# Altium project DVD.PrjPcb (part 3 of 3)
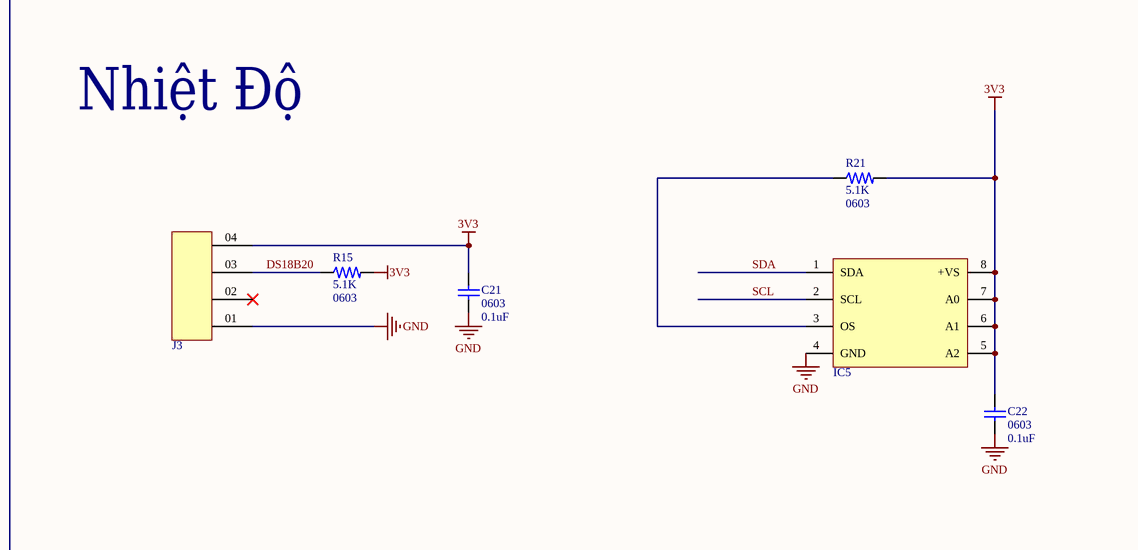
[diagram p7: DVD.SchDoc, bottom right]

## Sheet DVD.SchDoc (continued)

### Library data of the parts (continued)
R12 = RES; 2.2K; SMD; 0603; RMCF0603FT2K20: Res Thick Film 0603 2.2K Ohm 1% 0.1W(1/10W) ±100ppm/C Pad SMD Automotive T/R; Manufacturer: Stackpole Electronics; Voltage Rating: 75V; Designer: TVBac; Power Rating: 100mW; Temperature Coefficient: 100ppm/°C; Supplier: Digikey; Supplier Part Number: RMCF0603FT2K20CT-ND; Manufacturer Part Number: RMCF0603FT2K20; RoHS: Yes; Category: Chip SMD Resistors; Stock: 496567; Pricing: 1=0.1, 10=0.015, 50=0.0092, 100=0.0075, 500=0.0049, 1000=0.00415 (USD); Lead Free: Lead Free; ComponentLink1URL: http://components.arrow.com/part/dataview/46931077S7088098N1174?src-supplier=Arrow+Electronics; ComponentLink1Description: http://components.arrow.com/part/dataview/46931077S7088098N1174?src-supplier=Arrow+Electronics; ComponentLink2URL: https://datasheet.octopart.com/RMCF0603FT2K20-Stackpole-Electronics-datasheet-11547379.pdf?src-supplier=Future+Electronics; ComponentLink2Description: https://datasheet.octopart.com/RMCF0603FT2K20-Stackpole-Electronics-datasheet-11547379.pdf?src-supplier=Future+Electronics; ComponentLink3URL: https://www.seielect.com/catalog/SEI-RMCF_RMCP.pdf?src-supplier=Avnet; ComponentLink3Description: https://www.seielect.com/catalog/SEI-RMCF_RMCP.pdf?src-supplier=Avnet; ComponentLink4Description: http://www.seielect.com/Catalog/SEI-rmc.pdf?src-supplier=Future+Electronics; ComponentLink4URL: http://www.seielect.com/Catalog/SEI-rmc.pdf?src-supplier=Future+Electronics; Mounting Technology: Surface Mount; Case/Package: 0603; Case Code (Metric): 1608; Case Code (Imperial): 0603; Contact Plating: Tin,Matte; Min Operating Temperature: -55°C; Max Operating Temperature: 155°C; Tolerance: 1%; Packaging: Tape and Reel; Number of Terminations: 2; Max Power Dissipation: 100mW; Features: Automotive AEC-Q200; Series: RMCF; Length: 0.061inch; Width: 0.031inch; Height: 0.022inch; Ratings: AEC-Q200; Radiation Hardening: No; RoHS Compliant: Yes; ComponentLink5URL: https://www.seielect.com/catalog/SEI-Packaging.pdf?src-supplier=Digikey; ComponentLink5Description: https://www.seielect.com/catalog/SEI-Packaging.pdf?src-supplier=Digikey; ComponentLink6Description: Link Digikey; ComponentLink6URL: https://www.digikey.com/en/products/detail/stackpole-electronics-inc/RMCF0603FT2K20/1760987
R16 R17 R24 = RES; 10R; SMD; 0603; RMCF0603FT10R0: SMD Chip Resistor, 100 kOhm, ± 1%, 100 mW, 0603 [1608 Metric], Thick Film, General Purpose; Manufacturer: Stackpole Electronics; Max Power Dissipation: 100mW; Temperature Coefficient: 100ppm/°C; Voltage Rating: 75V; Designer: TVBac; Supplier: Digikey; Supplier Part Number: RMCF0603FT10R0CT-ND; Manufacturer Part Number: RMCF0603FT10R0; RoHS: Yes; Category: Chip SMD Resistors; Stock: 1228366; Pricing: 1=0.1, 10=0.015, 50=0.009, 100=0.0075, 500=0.00498, 1000=0.00425 (USD); Mounting Technology: Surface Mount; Case/Package: 0603; Case Code (Metric): 1608; Case Code (Imperial): 0603; Contact Plating: Tin,Matte; Min Operating Temperature: -55°C; Max Operating Temperature: 155°C; Packaging: Tape and Reel; Tolerance: 1%; Number of Terminations: 2; Features: Automotive AEC-Q200; Series: RMCF; Construction: Rectangular; Length: 1.55mm; Width: 0.031inch; Height: 0.022inch; Depth: 0.8mm; Radiation Hardening: No; Military Standard: Not; RoHS Compliant: Yes; ComponentLink1URL: http://components.arrow.com/part/dataview/44988319S6756893N1174?src-supplier=Arrow+Electronics; ComponentLink1Description: http://components.arrow.com/part/dataview/44988319S6756893N1174?src-supplier=Arrow+Electronics; ComponentLink2URL: https://www.seielect.com/catalog/SEI-RMCF_RMCP.pdf?src-supplier=Avnet; ComponentLink2Description: https://www.seielect.com/catalog/SEI-RMCF_RMCP.pdf?src-supplier=Avnet; ComponentLink3URL: https://www.verical.com/server-webapp/html/getDatasheet?partID=372827&src-supplier=Verical; ComponentLink3Description: https://www.verical.com/server-webapp/html/getDatasheet?partID=372827&src-supplier=Verical; ComponentLink4URL: https://www.seielect.com/catalog/SEI-Packaging.pdf?src-supplier=Digikey; ComponentLink4Description: https://www.seielect.com/catalog/SEI-Packaging.pdf?src-supplier=Digikey
R18 R20 = RES; 4.7K; 0603; SMD; SFR03EZPF4701: Res Anti-Sulfured Thick Film 0603 4.7k Ohm 1% 1/10W ±100ppm/°C Molded Paper T/R; Manufacturer: Rohm; Power Rating: 100mW; Voltage Rating (DC): 50V; Designer: TVBac; Supplier: Mouser; Supplier Part Number: 755-SFR03EZPF4701; Manufacturer Part Number: SFR03EZPF4701; RoHS: Yes; Category: Chip SMD Resistors; Stock: 30180; Pricing: 1=0.14, 10=0.045, 50=0.045, 100=0.027, 1000=0.02, 10000=0.014 (USD); ComponentLink1URL: http://www.farnell.com/datasheets/2611943.pdf?src-supplier=Farnell; ComponentLink1Description: http://www.farnell.com/datasheets/2611943.pdf?src-supplier=Farnell; ComponentLink2URL: http://www.farnell.com/datasheets/2611943.pdf?src-supplier=Newark; ComponentLink2Description: http://www.farnell.com/datasheets/2611943.pdf?src-supplier=Newark; ComponentLink3URL: http://www.farnell.com/datasheets/2611943.pdf?src-supplier=Element14; ComponentLink3Description: http://www.farnell.com/datasheets/2611943.pdf?src-supplier=Element14; ComponentLink4URL: https://www.rohm.com/datasheet/SFR03EZPF/sfr-e?src-supplier=Digikey; ComponentLink4Description: https://www.rohm.com/datasheet/SFR03EZPF/sfr-e?src-supplier=Digikey; ComponentLink5Description: Link Digikey; ComponentLink5URL: https://www.digikey.com/en/products/detail/rohm-semiconductor/SFR03EZPF4701/9771855
R25 = RES; 100R; 0603; SMD; KTR03EZPF1000: Res Thick Film 0603 100 Ohm 1% 0.1W(1/10W) ±100ppm/C Pad SMD T/R Automotive AEC-Q200; Manufacturer: Rohm; Max Power Dissipation: 100mW; Temperature Coefficient: 100ppm/°C; Voltage Rating: 350V; Designer: TVBac; Supplier: Mouser; Supplier Part Number: 755-KTR03EZPF1000; Manufacturer Part Number: KTR03EZPF1000; RoHS: Yes; Category: Chip SMD Resistors; Stock: 66325; Pricing: 1=0.12, 10=0.039, 50=0.039, 100=0.024, 1000=0.021, 10000=0.015 (USD); Case/Package: 0603; Case Code (Metric): 1608; Case Code (Imperial): 0603; Min Operating Temperature: -55°C; Max Operating Temperature: 155°C; Packaging: Cut Tape; Tolerance: 1%; Number of Terminations: 2; Features: Automotive AEC-Q200; Series: KTR; Voltage Rating (DC): 350V; Ratings: AEC-Q200; RoHS Compliant: Yes; ComponentLink1URL: https://datasheet.ciiva.com/14926/ktr-14926472.pdf?src-supplier=Digikey; ComponentLink1Description: https://datasheet.ciiva.com/14926/ktr-14926472.pdf?src-supplier=Digikey; ComponentLink2URL: https://datasheet.ciiva.com/14932/ktr-14932133.pdf?src-supplier=Digikey; ComponentLink2Description: https://datasheet.ciiva.com/14932/ktr-14932133.pdf?src-supplier=Digikey; ComponentLink3Description: Link Digikey; ComponentLink3URL: https://www.digikey.com/en/products/detail/rohm-semiconductor/KTR03EZPF1000/4051558
R26 = RES; 0R; 0603; SMD;  RMCF0603ZT0R00: Res Thick 0603 0 Ohm Jumper 1/10W 100Ppm/ C Smd Rohs Compliant: Yes; Manufacturer: Stackpole Electronics; Max Power Dissipation: 100mW; Voltage Rating: 75V; Designer: TVBac; Supplier: Digikey; Supplier Part Number: RMCF0603ZT0R00CT-ND; Manufacturer Part Number: RMCF0603ZT0R00; RoHS: Yes; Category: Chip SMD Resistors; Stock: 5949380; Pricing: 1=0.1, 10=0.013, 25=0.0096, 50=0.0072, 100=0.0051, 250=0.00408, 500=0.00328, 1000=0.00241, 5000=0.00173, 10000=0.0015, 25000=0.00132, 50000=0.00121, 125000=0.00118 (USD); Mounting Technology: Surface Mount; Case/Package: 0603; Case Code (Metric): 1608; Case Code (Imperial): 0603; Contact Plating: Tin,Matte; Min Operating Temperature: -55°C; Max Operating Temperature: 155°C; Packaging: Tape and Reel; Number of Terminations: 2; Features: Automotive AEC-Q200; Series: RMCF; Construction: Rectangular; Length: 1.55mm; Width: 0.031inch; Height: 0.022inch; Depth: 0.8mm; Radiation Hardening: No; Lead Free: 5697LeadFree; Military Standard: Not; RoHS Compliant: Yes; ComponentLink1URL: https://datasheet.octopart.com/RMCF0603ZT0R00-Stackpole-Electronics-datasheet-11547379.pdf?src-supplier=Future+Electronics; ComponentLink1Description: https://datasheet.octopart.com/RMCF0603ZT0R00-Stackpole-Electronics-datasheet-11547379.pdf?src-supplier=Future+Electronics; ComponentLink2URL: https://www.seielect.com/catalog/SEI-Packaging.pdf?src-supplier=Avnet; ComponentLink2Description: https://www.seielect.com/catalog/SEI-Packaging.pdf?src-supplier=Avnet; ComponentLink3URL: https://www.seielect.com/catalog/SEI-Packaging.pdf?src-supplier=Arrow+Electronics; ComponentLink3Description: https://www.seielect.com/catalog/SEI-Packaging.pdf?src-supplier=Arrow+Electronics; ComponentLink4URL: https://www.seielect.com/catalog/SEI-Packaging.pdf?src-supplier=Verical; ComponentLink4Description: https://www.seielect.com/catalog/SEI-Packaging.pdf?src-supplier=Verical; ComponentLink5URL: https://www.seielect.com/Catalog/SEI-RMCF_RMCP.pdf?src-supplier=Digikey; ComponentLink5Description: https://www.seielect.com/Catalog/SEI-RMCF_RMCP.pdf?src-supplier=Digikey; ComponentLink6URL: https://www.seielect.com/catalog/SEI-Packaging.pdf?src-supplier=Digikey; ComponentLink6Description: https://www.seielect.com/catalog/SEI-Packaging.pdf?src-supplier=Digikey; ComponentLink7URL: https://datasheet.octopart.com/RMCF0603ZT0R00-Stackpole-Electronics-datasheet-154799224.pdf?src-supplier=Master+Electronics; ComponentLink7Description: https://datasheet.octopart.com/RMCF0603ZT0R00-Stackpole-Electronics-datasheet-154799224.pdf?src-supplier=Master+Electronics; ComponentLink8Description: Link Digikey; ComponentLink8URL: https://www.digikey.com/en/products/detail/stackpole-electronics-inc/RMCF0603ZT0R00/1756908
R_shunt1 = RES; SHUNT; 10mOhm; SMD; WFMA2512R0100FEA: Res Current Sense Metal Plate 2512 0.01 Ohm 1% 3W ±110ppm/°C Molded T/R; Manufacturer: Vishay; Designer: TVBac; Supplier: Digikey; Supplier Part Number: 541-10292-6-ND; Manufacturer Part Number: WFMA2512R0100FEA; RoHS: Yes; Category: Chip SMD Resistors; Pricing: 1=2.85, 10=1.682, 25=1.3844, 50=1.2026, 100=1.0506, 250=0.88712, 500=0.78654, 1000=0.70625 (USD); Power Rating: 3W; Temperature Coefficient: 110ppm/°C; ComponentLink1URL: http://www.vishay.com/docs/30387/wfm.pdf?src-supplier=Digikey; ComponentLink1Description: http://www.vishay.com/docs/30387/wfm.pdf?src-supplier=Digikey; ComponentLink2URL: http://www.farnell.com/datasheets/2793367.pdf?src-supplier=Newark; ComponentLink2Description: http://www.farnell.com/datasheets/2793367.pdf?src-supplier=Newark; ComponentLink3Description: Link Digikey; ComponentLink3URL: https://www.digikey.com/en/products/detail/vishay-dale/WFMA2512R0100FEA/9992531; ComponentLink4Description: Link CXT; ComponentLink4URL: https://linhkien.cxt.vn/3121-wfma2512r0100fea-tro-001-ohms-1-3w.html
S1 = 1042: Battery Holder, SMT, Nylon, High Temp, UL 94V-O, 1 Cell, 18650 | Keystone Electronics 1042; Supplier: Future Electronics; Supplier Part Number: 8033674; Manufacturer: Keystone Electronics; Manufacturer Part Number: 1042; RoHS: Yes; Category: LDO; Stock: 1600; Pricing: 200=2.74, 600=2.68, 800=2.66, 2000=2.61, 3000=2.56 (USD); Lead Free: 5697LeadFree; ComponentLink1URL: https://datasheet.ciiva.com/3353/key1042-rev-eng-tds-3353207.pdf?src-supplier=Distrelec; ComponentLink1Description: https://datasheet.ciiva.com/3353/key1042-rev-eng-tds-3353207.pdf?src-supplier=Distrelec; ComponentLink2URL: https://datasheet.ciiva.com/4/1042-4715.pdf?src-supplier=Digikey; ComponentLink2Description: https://datasheet.ciiva.com/4/1042-4715.pdf?src-supplier=Digikey
SW1 SW2 = BUT; SW; SMD; PTS636SM50JSMTRLFS: Switch Tactile N.O. SPST Rectangular Button J-Bend 0.05A 12VDC 1.77N SMD T/R; Manufacturer: ITT C&K; Contact Resistance: 100mR; Number of Positions: 2NUMBER; Supplier: Digikey; Supplier Part Number: CKN12319-1-ND; Manufacturer Part Number: PTS636SM50JSMTRLFS; RoHS: No; Category: Tactile Switches; Stock: 80725; Pricing: 1=0.21, 10=0.199, 25=0.1888, 100=0.1717, 250=0.1614, 500=0.14766 (USD); ComponentLink1Description: Link Digikey; ComponentLink1URL: https://www.digikey.com/en/products/detail/c-k/PTS636-SM50J-SMTR-LFS/10071732